# EAGLE design FeatherTriac (EAGLE 7.4.0)
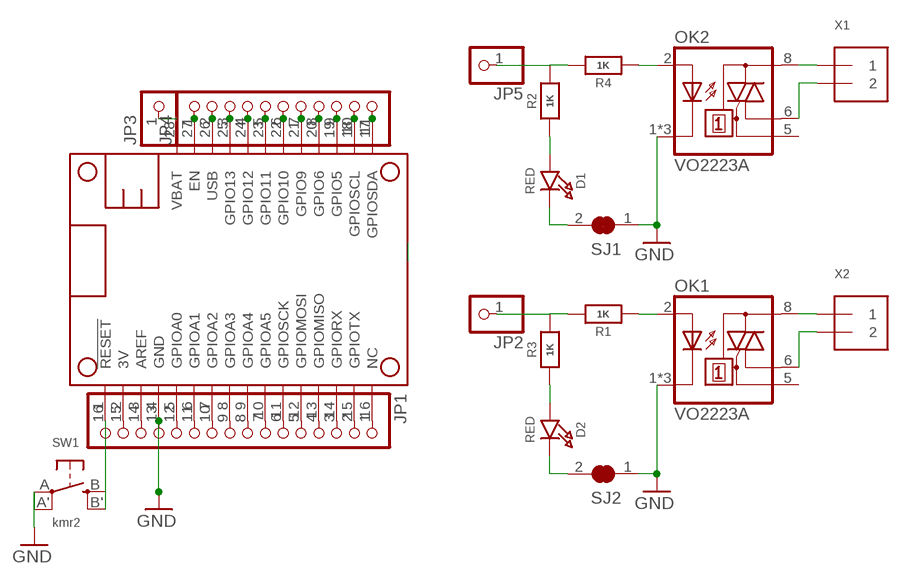
[diagram p0: schematic, sheet 1]

## Parts
D1  RED  LED0805_NOOUTLINE  [CHIPLED_0805_NOOUTLINE]
D2  RED  LED0805_NOOUTLINE  [CHIPLED_0805_NOOUTLINE]
JP1  HEADER-1X16ROUND  [1X16_ROUND]
JP2  HEADER-1X1ROUND  [1X01_ROUND]
JP3  HEADER-1X1ROUND  [1X01_ROUND]
JP4  HEADER-1X11  [1X11_ROUND]
JP5  HEADER-1X1ROUND  [1X01_ROUND]
MS1  MICROSHIELD  [MICROSHIELD]
OK1  VO2223A  [DIL7]
OK2  VO2223A  [DIL7]
R1  1K  RESISTOR0805_NOOUTLINE  [0805-NO]
R2  1K  RESISTOR0805_NOOUTLINE  [0805-NO]
R3  1K  RESISTOR0805_NOOUTLINE  [0805-NO]
R4  1K  RESISTOR0805_NOOUTLINE  [0805-NO]
SJ1  SOLDERJUMPER_CLOSED  [SOLDERJUMPER_CLOSEDWIRE]
SJ2  SOLDERJUMPER_CLOSED  [SOLDERJUMPER_CLOSEDWIRE]
SW1  kmr2  SWITCH_TACT_SMT4.6X2.8  [BTN_KMR2_4.6X2.8]
X1  TERMBLOCK_1X2  [TERMBLOCK_1X2-3.5MM]
X2  TERMBLOCK_1X2  [TERMBLOCK_1X2-3.5MM]

## Nets
3V: JP1.15 MS1.2(3V)
GND: JP1.13 MS1.4(GND) OK1.1(C) OK1.3(C) OK1.4(C) OK2.1(C) OK2.3(C) OK2.4(C) SJ1.1 SJ2.1 SW1.A'(P1) SW1.A(P)
N$1: D2.A R3.1
N$2: JP1.1 MS1.16(NC)
N$3: JP1.2 MS1.15(GPIOTX)
N$4: JP1.3 MS1.14(GPIORX)
N$5: JP1.4 MS1.13(GPIOMISO)
N$6: JP1.5 MS1.12(GPIOMOSI)
N$7: JP1.6 MS1.11(GPIOSCK)
N$8: JP1.7 MS1.10(GPIOA5)
N$9: JP1.8 MS1.9(GPIOA4)
N$10: JP1.9 MS1.8(GPIOA3)
N$11: JP1.10 MS1.7(GPIOA2)
N$12: JP1.11 MS1.6(GPIOA1)
N$13: JP1.12 MS1.5(GPIOA0)
N$14: JP4.1 MS1.27(EN)
N$15: JP4.3 MS1.25(GPIO13)
N$16: JP4.4 MS1.24(GPIO12)
N$17: JP4.5 MS1.23(GPIO11)
N$18: JP4.6 MS1.22(GPIO10)
N$19: JP4.7 MS1.21(GPIO9)
N$20: JP4.8 MS1.20(GPIO6)
N$21: JP4.9 MS1.19(GPIO5)
N$22: JP2.1 R1.2 R3.2
N$23: JP1.14 MS1.3(AREF)
N$24: D2.C SJ2.2
N$25: OK1.2(A) R1.1
N$27: OK1.8(T2) X2.1
N$28: OK1.6(T1) X2.2
N$29: D1.A R2.1
N$30: OK2.2(A) R4.1
N$31: JP5.1 R2.2 R4.2
N$32: D1.C SJ1.2
N$33: OK2.8(T2) X1.1
N$34: OK2.6(T1) X1.2
RESET: JP1.16 MS1.1(!RESET) SW1.B'(S1) SW1.B(S)
SCL: JP4.10 MS1.18(GPIOSCL)
SDA: JP4.11 MS1.17(GPIOSDA)
USB: JP4.2 MS1.26(USB)
VBAT: JP3.1 MS1.28(VBAT)
Unconnected: OK1.5(G) OK2.5(G)

## Library data of the parts
D1 D2 = microbuilder:LED: LED 0603 - 0603 Surface Mount Package 2mA: Green LED - Low Power (3.9mcd, 2ma, 1.7Vf) - Digikey: 475-2709-2-ND Orange LED - Low Power (9.8mcd, 2ma, 1.8Vf) - Digikey: 475-1194-2-ND Red LED - Low Power (5mcd, 2ma, 1.8Vf) - Digikey: 475-1195-2-ND Yellow LED - Low Power (7mcd, 2ma, 1.8Vf) - Digikey: 475-1196-2-ND 5mA: Blue LED - Low Power (17mcd, 5ma, 2.9Vf) - Digikey: LNJ937W8CRACT-ND 0805 - 0805 Surface Mount Package 2mA: Red LED (8.8mcd, 2mA, 1.8Vf, Clear) - Low Power [Digikey: 475-2510-1-ND] Green LED (5mcd, 2mA, 1.8Vf, Clear) - Low Power [Digikey: 475-2730-1-ND] Yellow LED (11.3mcd, 2mA, 1.8Vf, Clear) - Low Power [Digikey: 475-2555-1-ND] 20mA: Red LED (104mcd, 20mA, Diffused) - LS R976 [Digikey: 475-1278-6-ND] Red LED (12mcd, 20mA, 2.0Vf, Clear) - APT2012EC [Digikey: 754-1128-1-ND] Green LED (15mcd, 20mA, 2.2Vf, Clear) - APT2012GC [Digikey: 754-1131-1-ND] Orange LED (160mcd, 20mA, 2.1Vf, Clear) - APT2012SECK [Digikey: 754-1130-1-ND] 1206 - 1206 Surface Mount Package Green LED (26mcd, 20mA, Diffused) - LG N971 [Digikey: 475-1407-6-ND] Red LED (15mcd, 20mA, Diffused) - LH N974 [Digikey: 475-1416-6-ND] Cree - Cree High-Power Surface Mount LEDs XPEBWT-L1-0000-00D50 - White 111lm 350mA 2.9Vf 6200K 110° XTEAWT-00-0000-00000LEE3 - White 114lm 350mA 2.85Vf 5000K 115° Everlight - Everlight 45-21 Series Surface Mount LEDs 45-21/QK2C-B2832AC2CB2/2T - Warm White 2000mcd 20mA 3.25Vf 3050K 120° 45-21/LK2C-B38452C4CB2/2T - Nuetral White 2000mcd 20mA 3.25Vf 4150K 120° 45-21/LK2C-B50634C6CB2/2T - Cold White 2200mcd 20mA 3.25Vf 5650K 120° PLCC2 Reverse Mount LS T77K-J1L2-1-0-2-R18-Z - Red 11.25mcd 2mA 1.8Vf 630nm 120° LO T77K-L1M2-24-Z - Orange 19.6mcd 2mA 1.8Vf 606nm 120° LY T77K-K2M1-26-Z - Yellow 15.7mcd 2mA 1.8Vf 587nm 120°
JP1 = microbuilder:HEADER-1X16: PIN HEADER
JP2 JP3 JP5 = microbuilder:HEADER-1X1: PIN HEADER
JP4 = microbuilder:HEADER-1X11
MS1 = microbuilder:MICROSHIELD
OK1 OK2 = eto:VO2223A: 7-Pin DIP Zero-Cross Optoisolators Triac Driver Output (250/400 Volt Peak)
R1-R4 = microbuilder:RESISTOR: Resistors For new designs, use the packages preceded by an '_' character since they are more reliable: The following footprints should be used on most boards: _0402 - Standard footprint for regular board layouts _0603 - Standard footprint for regular board layouts _0805 - Standard footprint for regular board layouts _1206 - Standard footprint for regular board layouts For extremely tight-pitch boards where space is at a premium, the following 'micro-pitch' footprints can be used (smaller pads, no silkscreen outline, etc.): _0402MP - Micro-pitch footprint for very dense/compact boards _0603MP - Micro-pitch footprint for very dense/compact boards _0805MP - Micro-pitch footprint for very dense/compact boards _1206MP - Micro-pitch footprint for very dense/compact boards
SJ1 SJ2 = microbuilder:SOLDERJUMPER_CLOSED: Solder Jumper - Closed These solder jumpers are closed by default CLOSEDWIRE - 10 mil trace between pads that can be cut and resoldered later CLOSEDPERM - 63 mil trace between pads for a permanent connection (used to 'bridge' two signals, a shameless hack for Eagle). Can double as a test point as well (no cream layer)
SW1 = microbuilder:SWITCH_TACT_SMT: SMT Tact Switches 6x6mm - Digikey: P12940SCT-ND KMR2 (4.6x2.8mm) - Digikey: 401-1426-1-ND EVQ-PQHB55 - Light Touch, 160GF (4.5x4.5mm) - Digikey: P8090SCT-ND KMT0 - KMT021 NGJ LHS (etc.) IP68/Waterproof - Digikey: CKN10289CT-ND
X1 X2 = microbuilder:TERMBLOCK_1X2: 3.5mm Terminal block http://www.ladyada.net/library/pcb/eaglelibrary.html

## Net classes
1 HV: width 0.406 mm, drill 0.381 mm, clearance 1.016 mm

## Board
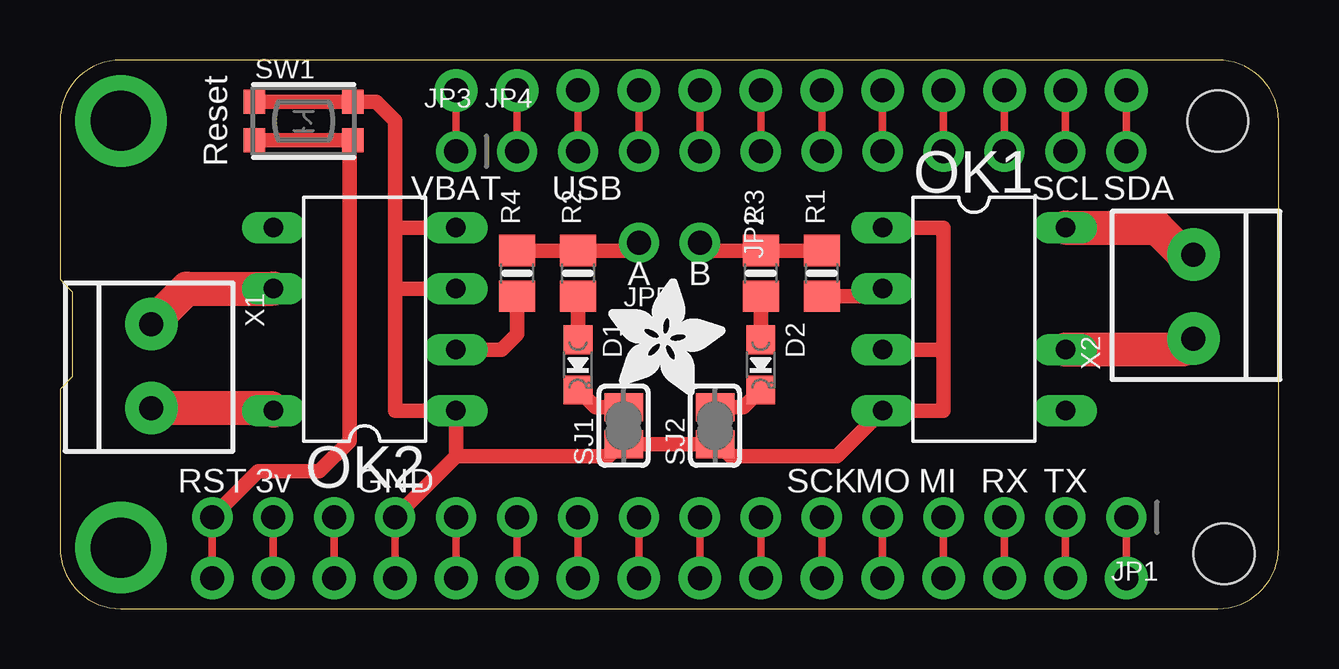
[diagram p1: board, top side]
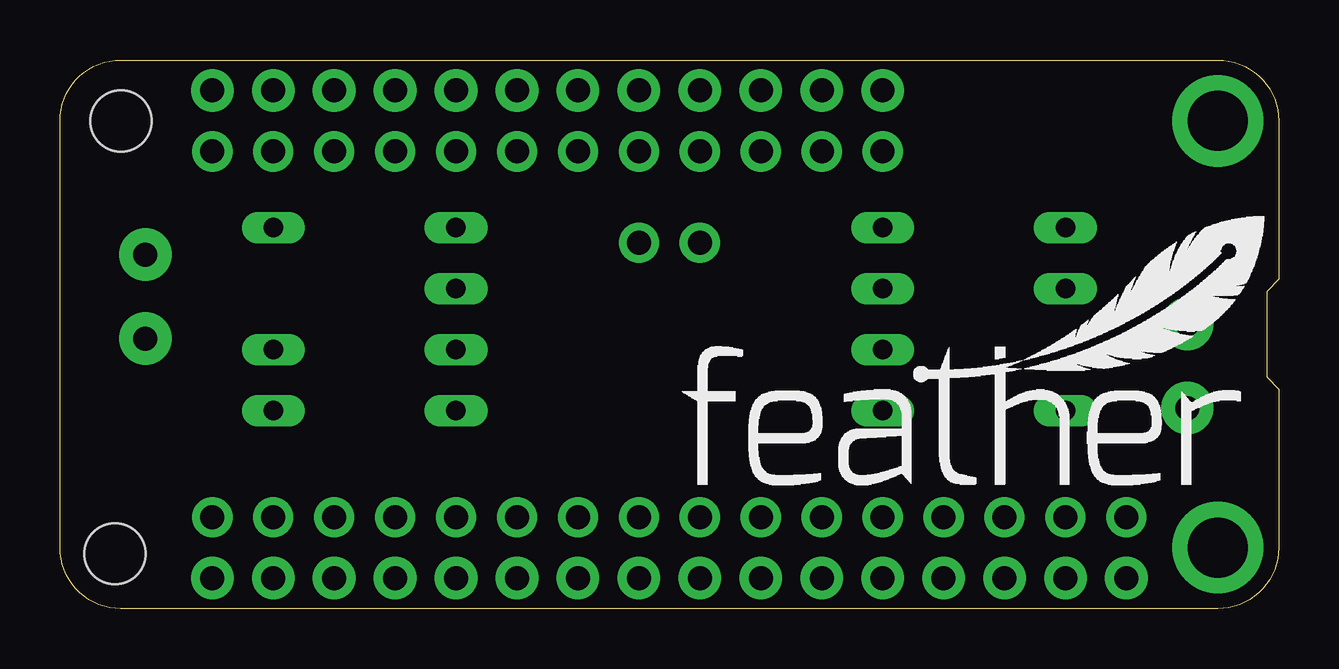
[diagram p2: board, bottom side, seen from below]

Size 50.8 x 22.86 mm. Coordinates in mm from the lower left corner, seen from the top.
Copper layers (1*16): Top 0.035mm / dielectric 1.5mm / Bottom 0.035mm
Design rules "adafruit": minimum track width 8mil, minimum drill 15.5mil, track to track 8mil, track to pad 8mil, pad to pad 8mil, via to via 8mil, smd to smd 8mil, copper to edge 10mil, drill to drill 8mil, minimum pad ring 10mil, minimum via ring 8mil, stop-mask expansion 2mil, vias tented up to drill 20mil, thermal gap 10mil

### Footprints (pad centres in the part's own frame; a part is rotated, then mirrored left to right if it is on the bottom)
CHIPLED_0805_NOOUTLINE = smd 1.2 x 1.2: A 0,-1.05; C 0,1.05
1X16_ROUND = drill 1 pad 1.676: 1 -19.05,0; 2 -16.51,0; 3 -13.97,0; 4 -11.43,0; 5 -8.89,0; 6 -6.35,0; 7 -3.81,0; 8 -1.27,0; 9 1.27,0; 10 3.81,0; 11 6.35,0; 12 8.89,0; 13 11.43,0; 14 13.97,0; 15 16.51,0; 16 19.05,0
1X01_ROUND = drill 1 pad 1.676: 1 0,0
1X11_ROUND = drill 1 pad 1.676: 1 -12.7,0; 2 -10.16,0; 3 -7.62,0; 4 -5.08,0; 5 -2.54,0; 6 0,0; 7 2.54,0; 8 5.08,0; 9 7.62,0; 10 10.16,0; 11 12.7,0
MICROSHIELD = drill 1 pad 1.778: 1 6.35,1.27; 2 8.89,1.27; 3 11.43,1.27; 4 13.97,1.27; 5 16.51,1.27; 6 19.05,1.27; 7 21.59,1.27; 8 24.13,1.27; 9 26.67,1.27; 10 29.21,1.27; 11 31.75,1.27; 12 34.29,1.27; 13 36.83,1.27; 14 39.37,1.27; 15 41.91,1.27; 16 44.45,1.27; 17 44.45,21.59; 18 41.91,21.59; 19 39.37,21.59; 20 36.83,21.59; 21 34.29,21.59; 22 31.75,21.59; 23 29.21,21.59; 24 26.67,21.59; 25 24.13,21.59; 26 21.59,21.59; 27 19.05,21.59; 28 16.51,21.59 | drill 2.5 pad 3.81: P$1 2.54,20.32; P$2 2.54,2.54 | hole 2.54: 48.26,20.32; 48.514,2.286
DIL7 = drill 0.813 long: 1 -3.81,-3.81; 2 -1.27,-3.81; 3 1.27,-3.81; 4 3.81,-3.81; 5 3.81,3.81; 6 1.27,3.81; 8 -3.81,3.81
0805-NO = smd 1.3 x 1.5: 1 -0.95,0; 2 0.95,0
SOLDERJUMPER_CLOSEDWIRE = smd 1.168 x 1.6: 1 -0.762,0; 2 0.762,0 | smd 0.635 x 0.203: WIRE 0,0
BTN_KMR2_4.6X2.8 = smd 0.9 x 1: A 2.05,0.8; A' -2.05,0.8; B 2.05,-0.8; B' -2.05,-0.8
TERMBLOCK_1X2-3.5MM = drill 1 pad 2.184: 1 1.8,0; 2 -1.7,0

### Placement (x,y rotation side)
D1  21.59,10.16 180 top
D2  29.21,10.16 180 top
JP1  25.4,3.81 180 top
JP2  26.67,15.24 270 top
JP3  16.51,19.05 0 top
JP4  31.75,19.05 0 top
JP5  24.13,15.24 180 top
MS1  0,0 0 top
OK1  38.1,12.06 270 top
OK2  12.7,12.06 90 top
R1  31.75,13.97 90 top
R2  21.59,13.97 90 top
R3  29.21,13.97 90 top
R4  19.05,13.97 90 top
SJ1  23.5,7.62 90 top
SJ2  27.3,7.62 90 top
SW1  10.16,20.32 0 top
U$6  [FEATHERLOGO]  24.89,5.08 0 bottom
U$7  [ADAFRUIT_5MM]  22.86,8.89 0 top
X1  3.81,10.16 270 top
X2  47.24,12.95 90 top

### Tracks (layer width: path | path; a pad name or v marks a point on that pad's centre or on a via)
3V
  Top 0.305: JP1.15 MS1.2
GND
  Top 0.305: MS1.4 JP1.13
  Top 0.61: OK1.1 36.83,15.88 36.83,10.79 | 36.83,10.79 OK1.3 | JP1.13 16.51,6.35 | 16.51,6.35 OK2.1 13.97,8.26 13.97,13.34 | 16.51,6.35 22.86,6.35 23.37,6.86 SJ1.1 SJ2.1 27.43,6.86 27.94,6.35 32.38,6.35 OK1.4 36.83,8.26 36.83,10.79 | SW1.A' SW1.A 13.17,21.12 13.97,20.32 13.97,15.88 | 14.61,15.88 OK2.4 13.97,15.88 | 13.97,13.34 13.97,15.88 | OK2.3 13.97,13.34
N$1
  Top 0.61: R3.1 D2.A
N$2
  Top 0.305: JP1.1 MS1.16
N$3
  Top 0.305: JP1.2 MS1.15
N$4
  Top 0.305: MS1.14 JP1.3
N$5
  Top 0.305: JP1.4 MS1.13
N$6
  Top 0.305: MS1.12 JP1.5
N$7
  Top 0.305: JP1.6 MS1.11
N$8
  Top 0.305: MS1.10 JP1.7
N$9
  Top 0.305: MS1.9 JP1.8
N$10
  Top 0.305: JP1.9 MS1.8
N$11
  Top 0.305: MS1.7 JP1.10
N$12
  Top 0.305: MS1.6 JP1.11
N$13
  Top 0.305: MS1.5 JP1.12
N$14
  Top 0.305: JP4.1 MS1.27
N$15
  Top 0.305: JP4.3 MS1.25
N$16
  Top 0.305: JP4.4 MS1.24
N$17
  Top 0.305: JP4.5 MS1.23
N$18
  Top 0.305: JP4.6 MS1.22
N$19
  Top 0.305: JP4.7 MS1.21
N$20
  Top 0.305: JP4.8 MS1.20
N$21
  Top 0.305: JP4.9 MS1.19
N$22
  Top 0.61: JP2.1 26.99,14.92 R3.2 R1.2
N$23
  Top 0.305: MS1.3 JP1.14
N$24
  Top 0.61: D2.C 28.48,8.38 SJ2.2
N$25
  Top 0.61: 32.32,12.95 R1.1 33.97,13.02 OK1.2
N$27
  Top 1.422: OK1.8 45.72,15.88 46.84,14.75 X2.1
N$28
  Top 1.422: X2.2 46.78,10.79 OK1.6
N$29
  Top 0.61: R2.1 D1.A
N$30
  Top 0.61: R4.1 19.05,11.43 18.41,10.79 OK2.2
N$31
  Top 0.61: JP5.1 23.81,14.92 R2.2 R4.2
N$32
  Top 0.61: D1.C 22.32,8.38 SJ1.2
N$33
  Top 1.422: OK2.8 8.79,8.36 X1.1
N$34
  Top 1.422: X1.2 5.29,13.34 OK2.6
RESET
  Top 0.305: JP1.16 MS1.1
  Top 0.61: SW1.B' SW1.B 12.06,19.38 12.06,6.99 10.79,5.71 8.26,5.71 JP1.16
SCL
  Top 0.305: JP4.10 MS1.18
SDA
  Top 0.305: MS1.17 JP4.11
USB
  Top 0.305: JP4.2 MS1.26
VBAT
  Top 0.305: MS1.28 JP3.1

### Text on the board
tPlace: Reset | VBAT | USB | SCL | SDA | A | B | RST | 3v | GND | SCK | MO | MI | RX | TX